# EAGLE design PerfBoard (EAGLE 7.1.0)
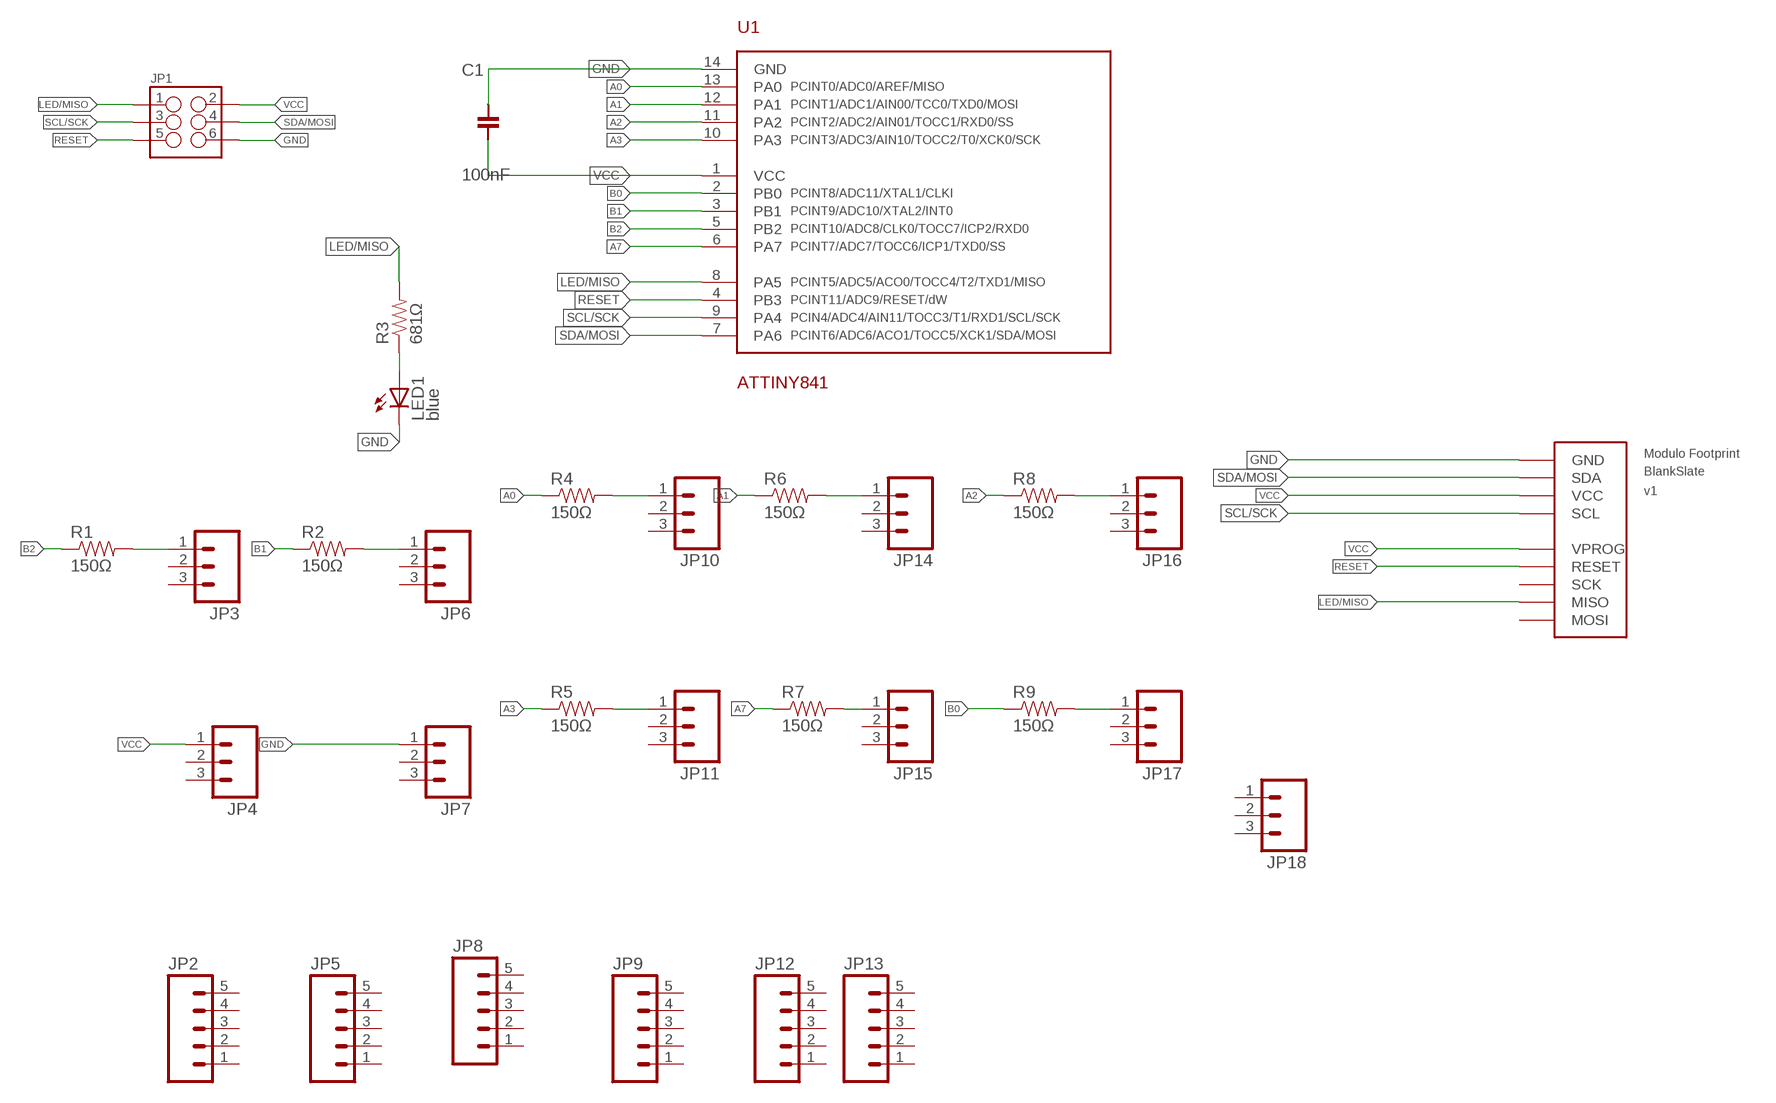
[diagram p0: schematic, sheet 1]

## Parts
C1  100nF  CAPACITOR-100NF  [0603]
JP1  M03X2  [2X3_SMD]
JP2  M05NO_SILK  [1X05_NO_SILK]
JP3  M031X03_NO_SILK  [1X03_NO_SILK]
JP4  M031X03_NO_SILK  [1X03_NO_SILK]
JP5  M05NO_SILK  [1X05_NO_SILK]
JP6  M031X03_NO_SILK  [1X03_NO_SILK]
JP7  M031X03_NO_SILK  [1X03_NO_SILK]
JP8  M05NO_SILK  [1X05_NO_SILK]
JP9  M05NO_SILK  [1X05_NO_SILK]
JP10  M031X03_NO_SILK  [1X03_NO_SILK]
JP11  M031X03_NO_SILK  [1X03_NO_SILK]
JP12  M05NO_SILK  [1X05_NO_SILK]
JP13  M05NO_SILK  [1X05_NO_SILK]
JP14  M031X03_NO_SILK  [1X03_NO_SILK]
JP15  M031X03_NO_SILK  [1X03_NO_SILK]
JP16  M031X03_NO_SILK  [1X03_NO_SILK]
JP17  M031X03_NO_SILK  [1X03_NO_SILK]
JP18  M031X03_NO_SILK  [1X03_NO_SILK]
LED1  blue  LED-0805-BLUE  [0805-LED]
PCB1  EXCLUDE  FOOTPRINTFOOTPRINT-2  [FOOTPRINT2]
R1  150Ω  RESISTOR-150Ω  [0603]
R2  150Ω  RESISTOR-150Ω  [0603]
R3  681Ω  RESISTOR-681Ω  [0603]
R4  150Ω  RESISTOR-150Ω  [0603]
R5  150Ω  RESISTOR-150Ω  [0603]
R6  150Ω  RESISTOR-150Ω  [0603]
R7  150Ω  RESISTOR-150Ω  [0603]
R8  150Ω  RESISTOR-150Ω  [0603]
R9  150Ω  RESISTOR-150Ω  [0603]
U1  ATTINY841  [SOIC-14]

## Nets
A0: R4.1 U1.13(PA0)
A1: R6.1 U1.12(PA1)
A2: R8.1 U1.11(PA2)
A3: R5.1 U1.10(PA3)
A7: R7.1 U1.6(PA7)
B0: R9.1 U1.2(PB0)
B1: R2.1 U1.3(PB1)
B2: R1.1 U1.5(PB2)
GND: C1.1 JP1.6 JP7.1 LED1.C PCB1.BUS0(GND) U1.14(GND)
LED/MISO: JP1.1 PCB1.PROG3(MISO) R3.2 U1.8(PA5)
N$2: LED1.A R3.1
N$3: JP3.1 R1.2
N$4: JP6.1 R2.2
N$6: JP10.1 R4.2
N$7: JP11.1 R5.2
N$8: JP15.1 R7.2
N$10: JP14.1 R6.2
N$11: JP16.1 R8.2
N$12: JP17.1 R9.2
RESET: JP1.5 PCB1.PROG1(RESET) U1.4(PB3)
SCL/SCK: JP1.3 PCB1.BUS3(SCL) U1.9(PA4)
SDA/MOSI: JP1.4 PCB1.BUS1(SDA) U1.7(PA6)
VCC: C1.2 JP1.2 JP4.1 PCB1.BUS2(VCC) PCB1.PROG0(VPROG) U1.1(VCC)
Unconnected: JP2.1 JP2.2 JP2.3 JP2.4 JP2.5 JP3.2 JP3.3 JP4.2 JP4.3 JP5.1 JP5.2 JP5.3 JP5.4 JP5.5 JP6.2 JP6.3 JP7.2 JP7.3 JP8.1 JP8.2 JP8.3 JP8.4 JP8.5 JP9.1 JP9.2 JP9.3 JP9.4 JP9.5 JP10.2 JP10.3 JP11.2 JP11.3 JP12.1 JP12.2 JP12.3 JP12.4 JP12.5 JP13.1 JP13.2 JP13.3 JP13.4 JP13.5 JP14.2 JP14.3 JP15.2 JP15.3 JP16.2 JP16.3 JP17.2 JP17.3 JP18.1 JP18.2 JP18.3 PCB1.PROG2(SCK) PCB1.PROG4(MOSI)

## Library data of the parts
C1 = Modulo:CAPACITOR: Capacitor; PARTNUM: C0603C104K5RACTU
JP1 = SparkFun-Connectors:M03X2: 2x3 .1" header. Shrouded, with keying- CONN-10681 SMT- CONN-11415 Pogo pins- HW-11044; PROD_ID: CONN-11290
JP2 JP5 JP8 JP9 JP12 JP13 = SparkFun-Connectors:M05: Header 5 Standard 5-pin 0.1" header. Use with straight break away headers (SKU : PRT-00116), right angle break away headers (PRT-00553), swiss pins (PRT-00743), machine pins (PRT-00117), and female headers (PRT-00115). Molex polarized connector foot print use with SKU : PRT-08230 with associated crimp pins and housings.
JP3 JP4 JP6 JP7 JP10 JP11 JP14-JP18 = SparkFun-Connectors:M03: Header 3 Standard 3-pin 0.1" header. Use with straight break away headers (SKU : PRT-00116), right angle break away headers (PRT-00553), swiss pins (PRT-00743), machine pins (PRT-00117), and female headers (PRT-00115). Molex polarized connector foot print use with SKU : PRT-08232 with associated crimp pins and housings.
LED1 = Modulo:LED: LED; PARTNUM: LTST-C171TBKT
PCB1 = IntegerLabs:FOOTPRINT: Modulo Footprint; BOARD: BlankSlate; VERSION: v1
R1 R2 R4-R9 = Modulo:RESISTOR: Resistor Basic schematic elements and footprints for 0603, 1206, and PTH resistors.; PARTNUM: ERJ-3EKF1500V
R3 = Modulo:RESISTOR: Resistor Basic schematic elements and footprints for 0603, 1206, and PTH resistors.; PARTNUM: ERJ-3EKF6810V
U1 = Modulo:ATTINY841; PARTNUM: ATTINY841-SSUR

## Board
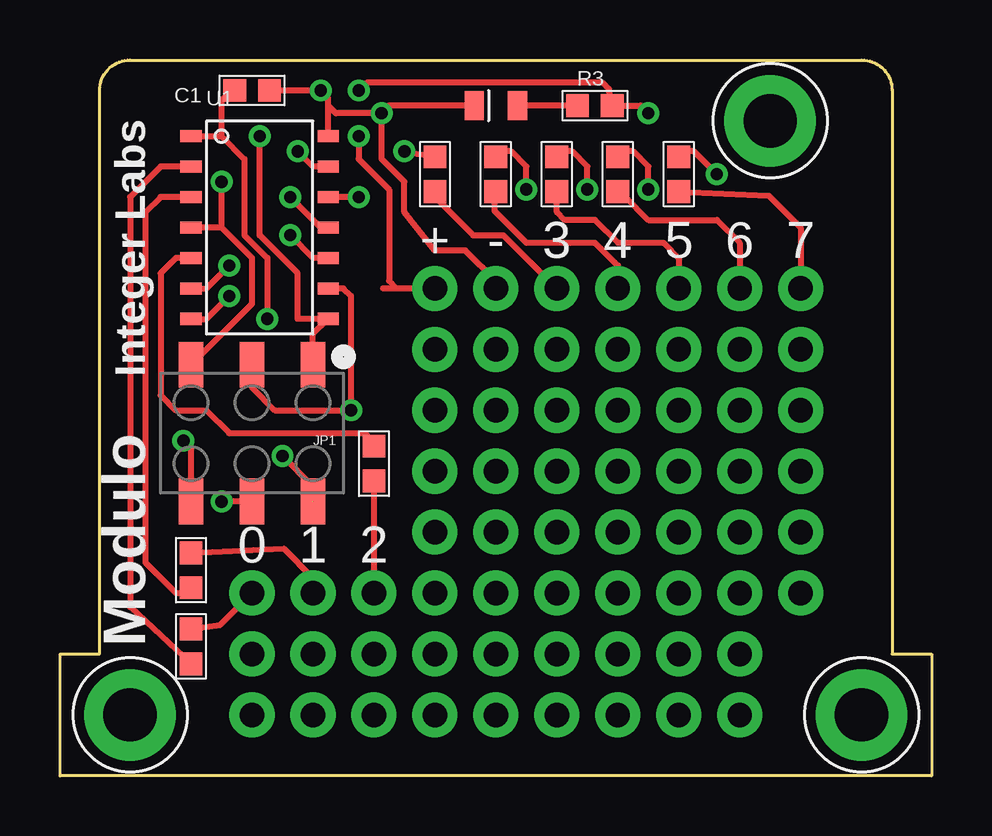
[diagram p1: board, top side]
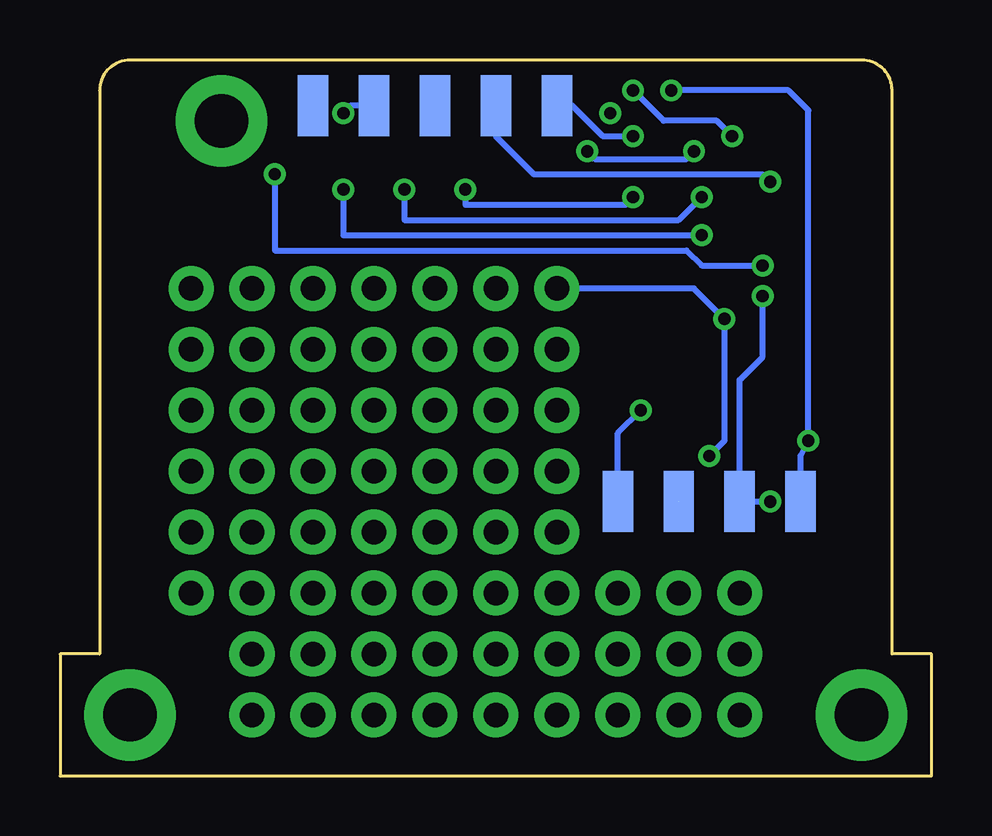
[diagram p2: board, bottom side, seen from below]

Size 36.32 x 29.84 mm. Coordinates in mm from the lower left corner, seen from the top.
Copper layers (1*16): Top 0.0178mm / dielectric 59mil / Bottom 0.0178mm
Design rules "SSC-EAGLE-2Lyr_v1.0.0.3": minimum track width 6mil, minimum drill 14mil, track to track 6mil, track to pad 6mil, pad to pad 6mil, via to via 6mil, smd to smd 6mil, copper to edge 20mil, drill to drill 16mil, minimum pad ring 8mil, minimum via ring 8mil, stop-mask expansion 3mil, vias tented up to drill 0mil, thermal gap 10mil

### Footprints (pad centres in the part's own frame; a part is rotated, then mirrored left to right if it is on the bottom)
0603 = smd 0.95 x 0.95: 1 -0.725,0; 2 0.725,0
2X3_SMD = smd 1.02 x 1.9: 1 -2.54,-2.85; 2 -2.54,2.85; 3 0,-2.85; 4 0,2.85; 5 2.54,-2.85; 6 2.54,2.85
1X05_NO_SILK = drill 1.016 pad 1.88: 1 0,0; 2 2.54,0; 3 5.08,0; 4 7.62,0; 5 10.16,0
1X03_NO_SILK = drill 1.016 pad 1.88: 1 0,0; 2 2.54,0; 3 5.08,0
0805-LED = smd 1.2 x 0.8: A 0,-0.9; C 0,0.9
FOOTPRINT2 = smd 1.27 x 2.54 bottom: BUS0 5.08,11.43; BUS1 7.62,11.43; BUS2 10.16,11.43; BUS3 12.7,11.43; PROG0 15.24,27.94; PROG1 17.78,27.94; PROG2 20.32,27.94; PROG3 22.86,27.94; PROG4 25.4,27.94 | drill 2.223 pad 3.81: P$1 2.54,2.54; P$2 33.02,2.54; P$3 29.21,27.305
SOIC-14 = smd 0.508 x 0.889: 1 0,-3.175; 2 1.27,-3.175; 3 2.54,-3.175; 4 3.81,-3.175; 5 5.08,-3.175; 6 6.35,-3.175; 7 7.62,-3.175; 8 7.62,2.54; 9 6.35,2.54; 10 5.08,2.54; 11 3.81,2.54; 12 2.54,2.54; 13 1.27,2.54; 14 0,2.54

### Placement (x,y rotation side)
C1  8,28.57 180 top
JP1  8,14.29 180 top
JP2  15.62,2.54 90 top
JP3  13.08,7.62 270 top
JP4  15.62,20.32 270 top
JP5  18.16,2.54 90 top
JP6  10.54,7.62 270 top
JP7  18.16,20.32 270 top
JP8  20.7,2.54 90 top
JP9  23.24,2.54 90 top
JP10  20.7,20.32 270 top
JP11  28.32,20.32 270 top
JP12  25.78,2.54 90 top
JP13  28.32,2.54 90 top
JP14  23.24,20.32 270 top
JP15  30.86,20.32 270 top
JP16  25.78,20.32 270 top
JP17  8,7.62 270 top
JP18  30.86,12.7 270 top
LED1  18.16,27.94 90 top
PCB1  0.38,0 0 top
R1  13.08,13.02 270 top
R2  5.46,8.57 90 top
R3  22.29,27.94 0 top
R4  15.62,25.08 270 top
R5  23.24,25.08 270 top
R6  18.16,25.08 270 top
R7  25.78,25.08 270 top
R8  20.7,25.08 270 top
R9  5.46,5.4 90 top
U1  8.64,26.67 270 top

### Tracks (layer width: path | path; a pad name or v marks a point on that pad's centre or on a via)
A0  (via drill 0.51 pad 0.25)
  Top 0.254: R4.1 14.4,25.98 v14.35,26.04 | U1.13 10.54,25.4 v9.91,26.04
  Bottom 0.254: v14.35,26.04 14.03,25.72 10.22,25.72 v9.91,26.04
A1  (via drill 0.51 pad 0.25)
  Top 0.254: v12.45,24.13 U1.12 | v19.43,24.45 19.43,25.4 18.8,26.04 18.21,26.04 R6.1
  Bottom 0.254: v19.43,24.45 19.43,23.81 12.76,23.81 v12.45,24.13
A2  (via drill 0.51 pad 0.25)
  Top 0.254: U1.11 10.86,22.86 v9.59,24.13 | v21.97,24.45 21.97,25.4 21.34,26.04 20.75,26.04 R8.1
  Bottom 0.254: v21.97,24.45 21.97,23.18 10.54,23.18 v9.59,24.13
A3  (via drill 0.51 pad 0.25)
  Top 0.254: U1.10 10.54,21.59 v9.59,22.54 | v24.51,24.45 24.51,25.4 23.88,26.04 23.29,26.04 R5.1
  Bottom 0.254: v24.51,24.45 24.51,22.54 v9.59,22.54
A7  (via drill 0.51 pad 0.25)
  Top 0.254: U1.6 6.1,20.32 v7.05,21.27 | v27.37,25.08 26.42,26.04 25.83,26.04 R7.1
  Bottom 0.254: v27.37,25.08 27.37,21.91 10.22,21.91 9.59,21.27 v7.05,21.27
B0
  Top 0.254: U1.2 4.19,25.4 2.92,24.13 2.92,7.04 R9.1
B1
  Top 0.254: U1.3 4.19,24.13 3.56,23.5 3.56,8.89 4.83,7.62 5.41,7.62 R2.1
B2
  Top 0.254: U1.5 4.83,21.59 4.19,20.95 4.19,15.88 4.83,15.24 6.1,15.24 7.05,14.29 12.71,14.29 R1.1
GND  (via drill 0.51 pad 0.25)
  Top 0.254: JP1.6 5.46,13.65 v5.14,13.97 | JP7.1 18.16,20.64 16.89,21.91 15.62,21.91 14.35,23.5 14.35,24.77 13.4,25.72 v13.4,27.62 | LED1.C 13.72,27.94 v13.4,27.62 | C1.1 v10.86,28.57 11.18,28.26 11.18,27.94 | U1.14 11.18,27.94 | v13.4,27.62 11.49,27.62 11.18,27.94
  Bottom 0.254: v10.86,28.57 5.97,28.57 5.14,27.75 v5.14,13.97 5.46,13.34 PCB1.BUS0
LED/MISO  (via drill 0.51 pad 0.25)
  Top 0.254: JP1.1 10.54,18.41 U1.8 9.91,19.05 9.91,20.95 8.32,22.54 v8.32,26.67 | v12.45,28.57 12.76,28.89 22.61,28.89 22.87,28.63 R3.2 24.19,27.94 v24.51,27.62
  Bottom 0.254: v8.32,26.67 8.95,27.3 11.18,27.3 v12.45,28.57 | PCB1.PROG3 24.19,27.94 v24.51,27.62
N$2
  Top 0.254: R3.1 LED1.A
N$3
  Top 0.254: R1.2 JP3.1
N$4
  Top 0.254: R2.2 9.32,9.47 10.54,8.26 JP6.1
N$6
  Top 0.254: R4.2 15.57,24.18 17.21,22.54 18.48,22.54 JP10.1
N$7
  Top 0.254: R5.2 23.51,24.18 24.51,23.18 27.37,23.18 28.32,22.23 JP11.1
N$8
  Top 0.254: R7.2 29.54,24.18 30.86,22.86 JP15.1
N$10
  Top 0.254: JP14.1 23.24,21.27 22.29,22.23 19.43,22.23 18.11,23.55 18.11,24.13 R6.2
N$11
  Top 0.254: JP16.1 25.78,21.59 25.15,22.23 23.24,22.23 22.29,23.18 21.02,23.18 20.7,23.5 R8.2
N$12
  Top 0.254: R9.2 6.68,6.3 JP17.1
RESET  (via drill 0.51 pad 0.25)
  Top 0.254: JP1.5 8,19.68 8,21.59 6.73,22.86 | 6.73,22.86 U1.4 | 6.73,22.86 v6.73,24.77
  Bottom 0.254: PCB1.PROG1 18.16,26.67 16.57,25.08 7.05,25.08 v6.73,24.77
SCL/SCK  (via drill 0.51 pad 0.25)
  Top 0.254: U1.9 11.81,20.32 12.13,20 v12.13,15.24 8.95,15.24 8,16.19 JP1.3
  Bottom 0.254: PCB1.BUS3 13.08,14.29 v12.13,15.24
SDA/MOSI  (via drill 0.51 pad 0.25)
  Top 0.254: U1.7 6.1,19.05 v7.05,20 | JP1.4 7.05,11.43 v6.73,11.43
  Bottom 0.254: v7.05,20 7.05,17.46 8,16.51 PCB1.BUS1 v6.73,11.43
VCC  (via drill 0.51 pad 0.25)  (1 unrouted)
  Top 0.254: 6.73,26.67 7.68,25.72 7.68,22.54 8.64,21.59 v8.64,19.05 | 6.73,26.67 6.73,28.2 C1.2 | JP4.1 14.03,20.32 | 14.03,20.32 13.45,20.32 | JP1.2 10.54,12.06 v9.27,13.34 | U1.1 6.73,26.67 | v12.45,26.67 12.45,25.72 13.72,24.45 13.72,20.64 14.03,20.32
  Bottom 0.254: JP4.1 9.91,20.32 v8.64,19.05 8.64,13.97 v9.27,13.34 | PCB1.PROG0 14.99,27.94 13.72,26.67 v12.45,26.67

### Text on the board
tPlace: + | - | 3 | 4 | 5 | 6 | 7 | 0 | 1 | 2